# Altium schematic sheet PS3604LR.SchDoc: PS3604LR (part 2 of 3)
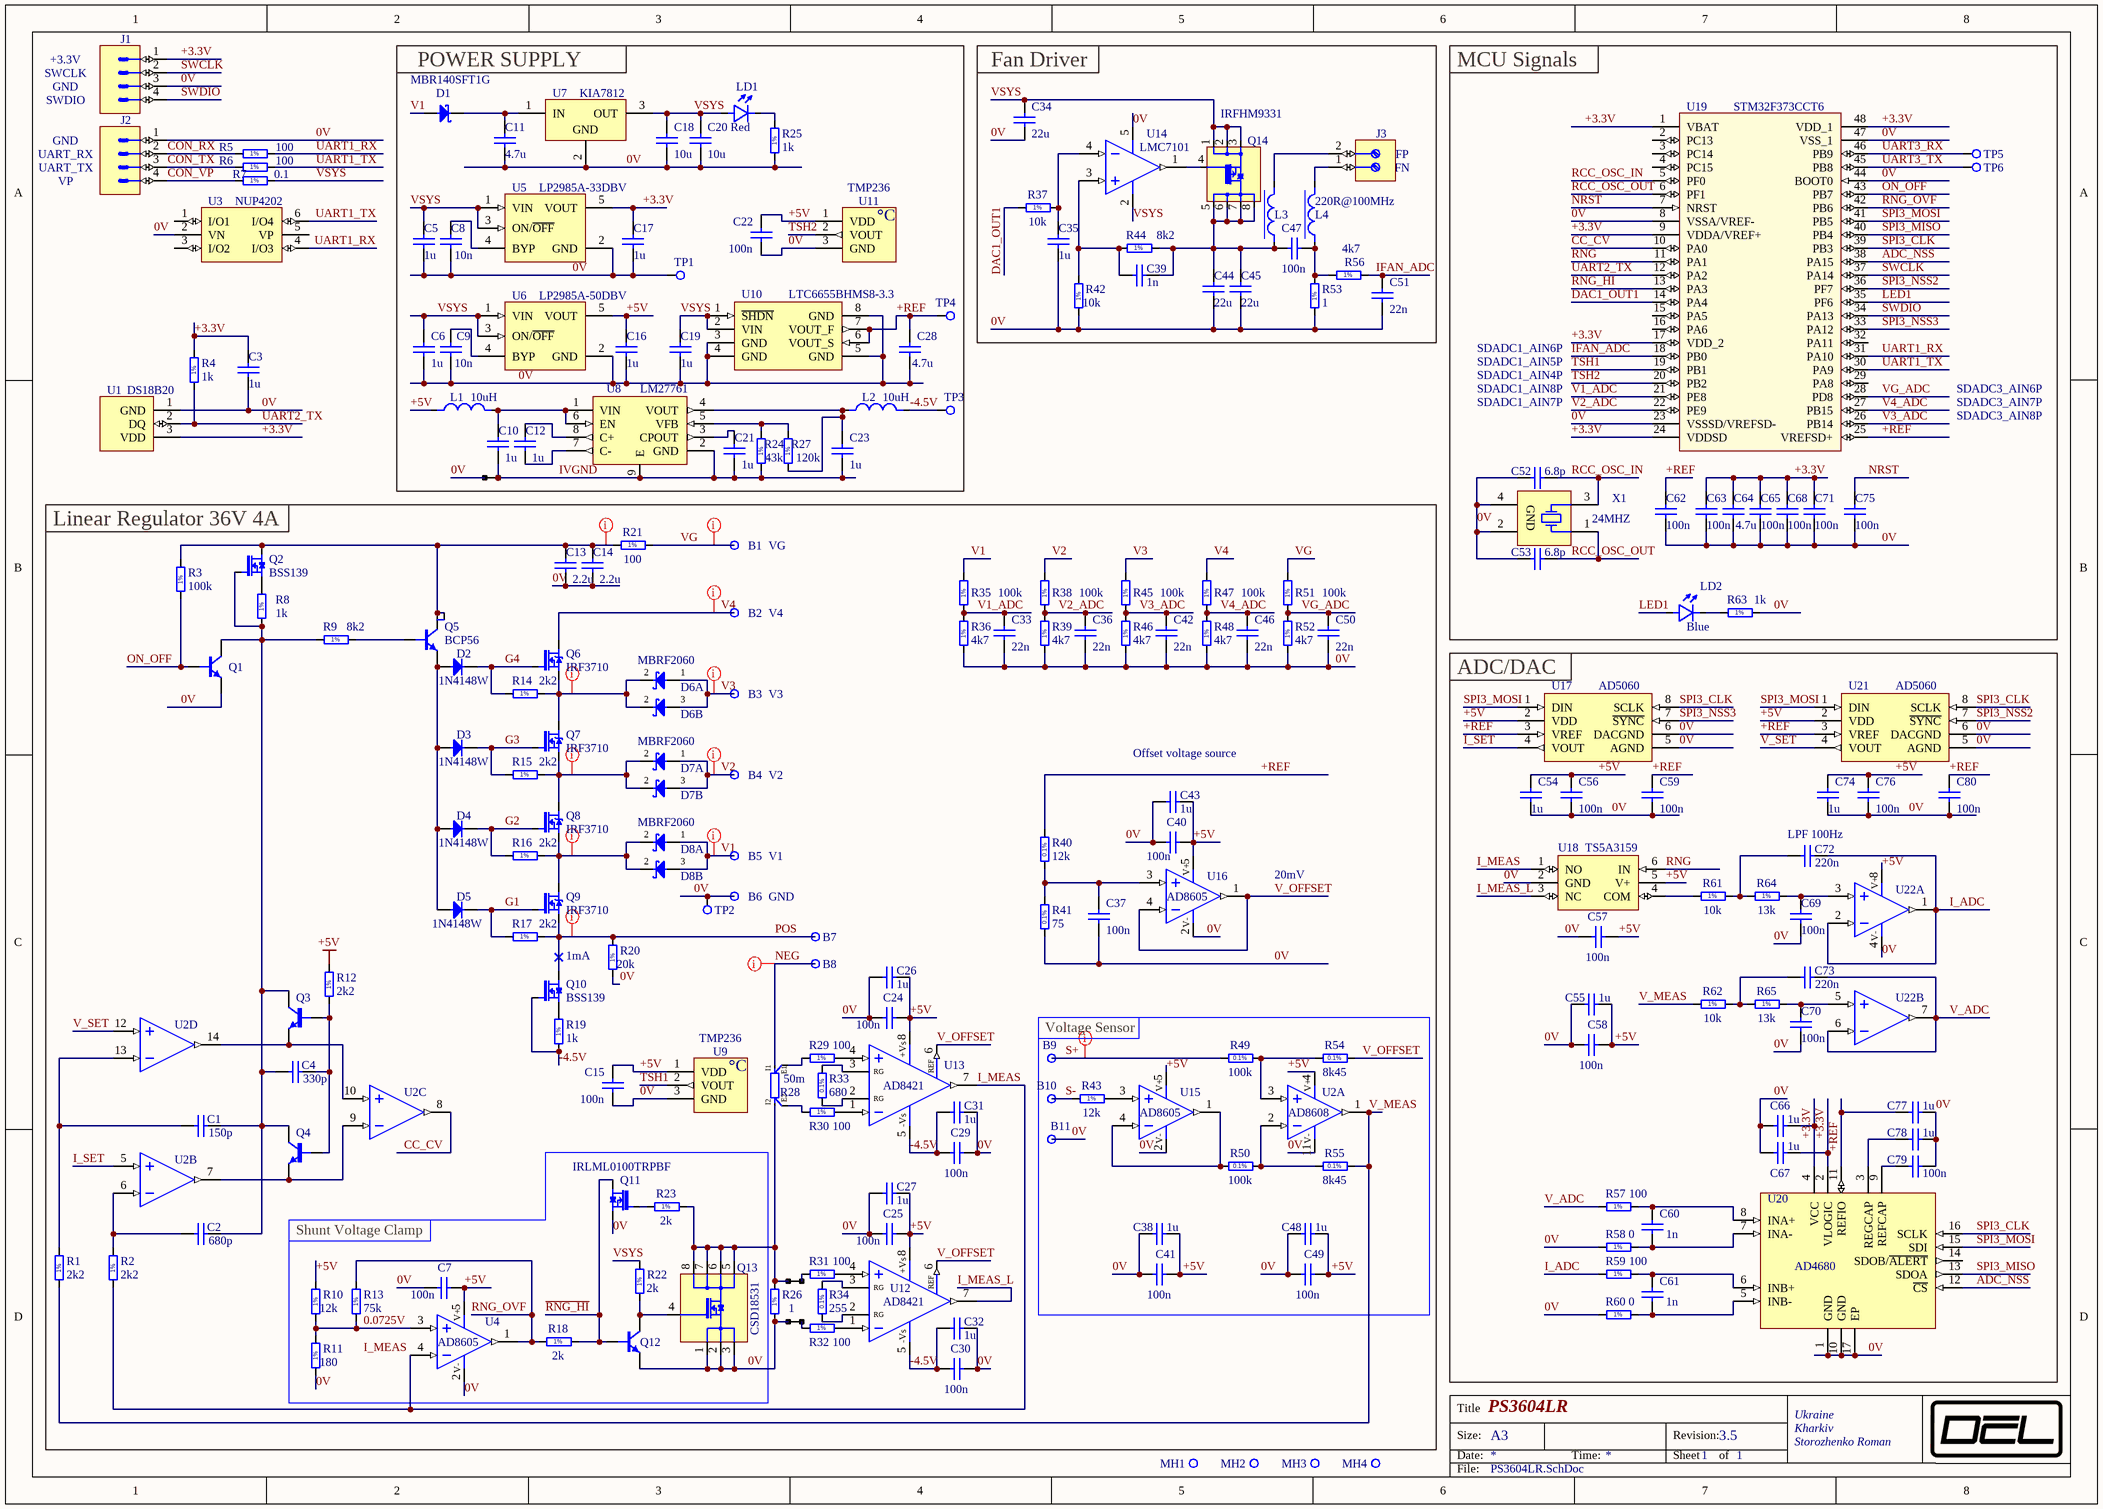
[diagram p1: PS3604LR.SchDoc]
## Library data of the parts
B1-B6 = PLATED_HOLE1.3_PAD2.5: Single Terminal Socket; Part Description: Plated Through Hole: Hole Dia.=1.3mm Pad Dia.=2.5mm; Mounted: No; Part Number: PLATED_HOLE1.3_PAD2.5; Component Kind: Standard (No BOM); Component Type: Standard (No BOM); Pin Count: 1; Family: Plated Hole; Socket: No; SMD: No; Status: None; ComponentHeight: 0mm; Author: DEL; CreateDate: 24.03.2018; LatestRevisionDate: 24.03.2018; PackageDescription: Plated Through Hole: Hole Dia.=1.3mm Pad Dia.=2.5mm
B7 B8 = PLATED_HOLE1.8_PAD3.2: Single Terminal Socket; Part Description: Plated Through Hole: Hole Dia.=1.8mm Pad Dia.=3.2mm; Mounted: No; Part Number: PLATED_HOLE1.8_PAD3.2; Component Kind: Standard (No BOM); Component Type: Standard (No BOM); Pin Count: 1; Family: Plated Hole; Socket: No; SMD: No; Status: None; ComponentHeight: 0mm; Author: DEL; CreateDate: 3/19/2026; LatestRevisionDate: 3/24/2018; PackageDescription: Plated Through Hole: Hole Dia.=1.8mm Pad Dia.=3.2mm
B9-B11 = PLATED_HOLE1.0_PAD1.5: Single Terminal Socket; Part Description: Plated Through Hole: Hole Dia.=1.0mm Pad Dia.=1.5mm; Mounted: No; Part Number: PLATED_HOLE1.0_PAD1.5; Component Kind: Standard (No BOM); Component Type: Standard (No BOM); Pin Count: 1; Family: Plated Hole; Socket: No; SMD: No; Status: None; ComponentHeight: 0mm; Author: CERN DEM JLC; CreateDate: 10/30/2008; LatestRevisionDate: 10/30/2008; PackageDescription: Plated Through Hole: Hole Dia.=1mm Pad Dia.=1.5mm
C1 = CC0805_150PF_50V_5%_NP0: Non-polarised capacitor; Part Description: SMD Multilayer Chip Ceramic Capacitor; Manufacturer: GENERIC; Manufacturer1 Part Number: B37940K5151J060; Voltage: 50V; TC: NP0; Tolerance: ±5%; Part Number: CC0805_150PF_50V_5%_NP0; Component Kind: Standard; Component Type: Standard; Pin Count: 2; Value: 150p; Status: Preferred; Manufacturer Part Number: CC0805_150PF_50V_5%_NP0; Case: 0805; Mounted: Yes; Socket: No; SMD: Yes; Manufacturer1 Example: EPCOS; Manufacturer1 ComponentHeight: 1.30mm; HelpURL: \\cern.ch\dfs\Applications\Altium\Datasheets\CC0805_NP0_EPCOS.pdf; Author: CERN DEM JLC; CreateDate: 12/3/2007; LatestRevisionDate: 12/3/2007
C2 = CC0805_680PF_50V_5%_NP0: Non-polarised capacitor; Part Description: SMD Multilayer Chip Ceramic Capacitor; Manufacturer: GENERIC; Manufacturer1 Part Number: 223886115681; Voltage: 50V; TC: NP0; Tolerance: ±5%; Part Number: CC0805_680PF_50V_5%_NP0; Component Kind: Standard; Component Type: Standard; Pin Count: 2; Value: 680p; Status: Preferred; Manufacturer Part Number: CC0805_680PF_50V_5%_NP0; Case: 0805; Mounted: Yes; Socket: No; SMD: Yes; Manufacturer1 Example: PHYCOMP; Manufacturer1 ComponentHeight: 1.35mm; HelpURL: \\cern.ch\dfs\Applications\Altium\Datasheets\CC0805_NP0_PHYCOMP.pdf; Author: CERN DEM JLC; CreateDate: 12/3/2007; LatestRevisionDate: 12/3/2007
C3 C5 C6 C10 C12 C16 C17 C19 C21 C23 C26 C27 C31 C32 C35 C38 C43 C48 C54 C55 C66 C67 C74 C77 C78 = CC0402_1UF_10V_20%_X5R: Non-polarised capacitor; Part Description: SMD Multilayer Chip Ceramic Capacitor; Manufacturer: GENERIC; Voltage: 10V; TC: X5R; Tolerance: ±20%; Part Number: CC0402_1UF_10V_20%_X5R; Component Kind: Standard; Component Type: Standard; Pin Count: 2; Value: 1u; Status: Preferred; Manufacturer Part Number: CC0402_1UF_10V_20%_X5R; Case: 0402; Mounted: Yes; Socket: No; SMD: Yes; Manufacturer1 ComponentHeight: 0.55mm; HelpURL: \\cern.ch\dfs\Applications\Altium\Datasheets\CC0402_X5R_KEMET.pdf; Author: ELMAN; CreateDate: 20.05.2015; LatestRevisionDate: 20.05.2015
C4 = CC0805_330PF_50V_5%_NP0: Non-polarised capacitor; Part Description: SMD Multilayer Chip Ceramic Capacitor; Manufacturer: GENERIC; Manufacturer1 Part Number: 223886115331; Voltage: 50V; TC: NP0; Tolerance: ±5%; Part Number: CC0805_330PF_50V_5%_NP0; Component Kind: Standard; Component Type: Standard; Pin Count: 2; Value: 330p; Status: Preferred; Manufacturer Part Number: CC0805_330PF_50V_5%_NP0; Case: 0805; Mounted: Yes; Socket: No; SMD: Yes; Manufacturer1 Example: PHYCOMP; Manufacturer1 ComponentHeight: 1.35mm; HelpURL: \\cern.ch\dfs\Applications\Altium\Datasheets\CC0805_NP0_PHYCOMP.pdf; Author: CERN DEM JLC; CreateDate: 12/3/2007; LatestRevisionDate: 12/3/2007
C7 C15 C22 C24 C25 C29 C30 C37 C40 C41 C47 C49 C56-C59 C62 C63 C65 C68-C71 C75 C76 C79 C80 = CC0402_100NF_50V_10%_X7R: Non-polarised capacitor; Part Description: SMD Multilayer Chip Ceramic Capacitor; Manufacturer: GENERIC; Manufacturer1 Part Number: C0402B104K500NU; Voltage: 50V; TC: X7R; Tolerance: ±10%; Part Number: CC0402_100NF_50V_10%_X7R; Component Kind: Standard; Component Type: Standard; Pin Count: 2; Value: 100n; Status: Not Recommended; Manufacturer Part Number: CC0402_100NF_50V_10%_X7R; Case: 0402; Mounted: Yes; Socket: No; SMD: Yes; Manufacturer1 Example: HITANO; Manufacturer1 ComponentHeight: 0.55mm; Author: DEL; CreateDate: 13.11.2017; LatestRevisionDate: 13.11.2017
C8 C9 = CC0402_10NF_50V_10%_X7R: Non-polarised capacitor; Part Description: SMD Multilayer Chip Ceramic Capacitor; Manufacturer: GENERIC; Manufacturer1 Part Number: C0402C103K5RACTU; Voltage: 50V; TC: X7R; Tolerance: ±10%; Part Number: CC0402_10NF_50V_10%_X7R; Component Kind: Standard; Component Type: Standard; Pin Count: 2; Value: 10n; Status: None; Manufacturer Part Number: CC0402_10NF_50V_10%_X7R; Case: 0402; Mounted: Yes; Socket: No; SMD: Yes; Manufacturer1 Example: KEMET; Manufacturer1 ComponentHeight: 0.55mm; Author: DEL; CreateDate: 19.12.2017; LatestRevisionDate: 19.12.2017
C11 = CC1206_4.7UF_50V_10%_X7R: Non-polarised capacitor; Part Description: SMD Multilayer Chip Ceramic Capacitor; Manufacturer: GENERIC; Manufacturer1 Part Number: CL31B475KBHNNNE; Voltage: 50V; TC: X7R; Tolerance: ±10%; Part Number: CC1206_4.7UF_50V_10%_X7R; Component Kind: Standard; Component Type: Standard; Pin Count: 2; Value: 4.7u; Status: Preferred; Manufacturer Part Number: CC1206_4.7UF_50V_10%_X7R; Case: 1206; Mounted: Yes; Socket: No; SMD: Yes; Manufacturer1 Example: SAMSUNG; Manufacturer1 ComponentHeight: 1.8mm; Author: DEL; CreateDate: 13.11.2017; LatestRevisionDate: 13.11.2017
C13 C14 = CC1206_2.2UF_100V_10%_X7R: Non-polarised capacitor; Part Description: SMD Multilayer Chip Ceramic Capacitor; Manufacturer: GENERIC; Manufacturer1 Part Number: C1206C225K4RAC; Voltage: 100V; TC: X7R; Tolerance: ±10%; Part Number: CC1206_2.2UF_100V_10%_X7R; Component Kind: Standard; Component Type: Standard; Pin Count: 2; Value: 2.2u; Status: Preferred; Manufacturer Part Number: CC1206_2.2UF_100V_10%_X7R; Case: 1206; Mounted: Yes; Socket: No; SMD: Yes; Manufacturer1 Example: SAMSUNG; Manufacturer1 ComponentHeight: 1.75mm; Author: DEL; CreateDate: 6/15/2025; LatestRevisionDate: 6/15/2025
C18 C20 = CC1206_10UF_16V_10%_X7R: Non-polarised capacitor; Part Description: SMD Multilayer Chip Ceramic Capacitor; Manufacturer: GENERIC; Manufacturer1 Part Number: C1206C106K4RAC; Voltage: 16V; TC: X7R; Tolerance: ±10%; Part Number: CC1206_10UF_16V_10%_X7R; Component Kind: Standard; Component Type: Standard; Pin Count: 2; Value: 10u; Status: Preferred; Manufacturer Part Number: CC1206_10uF_16V_10%_X7R; Case: 1206; Mounted: Yes; Socket: No; SMD: Yes; Manufacturer1 Example: KEMET; Manufacturer1 ComponentHeight: 1.8mm; HelpURL: \\cern.ch\dfs\Applications\Altium\Datasheets\CC1206_X7R_KEMET.pdf; Author: CERN DEM JLC; CreateDate: 2009-04-28; LatestRevisionDate: 2009-04-28
C28 C64 = CC0402_4.7UF_10V_20%_X5R: Non-polarised capacitor; Part Description: SMD Multilayer Chip Ceramic Capacitor; Manufacturer: GENERIC; Voltage: 10V; TC: X5R; Tolerance: ±20%; Part Number: CC0402_4.7UF_10V_20%_X5R; Component Kind: Standard; Component Type: Standard; Pin Count: 2; Value: 4.7u; Status: Preferred; Manufacturer Part Number: CC0402_4.7UF_10V_20%_X5R; Case: 0402; Mounted: Yes; Socket: No; SMD: Yes; Manufacturer1 ComponentHeight: 0.55mm; Author: DEL; CreateDate: 1/19/2025; LatestRevisionDate: 1/19/2025
C33 C36 C42 C46 C50 C51 = CC0402_22NF_16V_10%_X7R: Non-polarised capacitor; Part Description: SMD Multilayer Chip Ceramic Capacitor; Manufacturer: GENERIC; Manufacturer1 Part Number: 223878715641; Voltage: 16V; TC: X7R; Tolerance: ±10%; Part Number: CC0402_22NF_16V_10%_X7R; Component Kind: Standard; Component Type: Standard; Pin Count: 2; Value: 22n; Status: Not Recommended; Manufacturer Part Number: CC0402_22NF_16V_10%_X7R; Case: 0402; Mounted: Yes; Socket: No; SMD: Yes; Manufacturer1 Example: PHYCOMP; Manufacturer1 ComponentHeight: 0.55mm; HelpURL: \\cern.ch\dfs\Applications\Altium\Datasheets\CC0402_X7R_PHYCOMP.pdf; Author: CERN DEM JLC; CreateDate: 03.12.2007; LatestRevisionDate: 03.12.2007
C34 C44 C45 = CC1206_22UF_16V_20%_X5R: Non-polarised capacitor; Part Description: SMD Multilayer Chip Ceramic Capacitor; Manufacturer: GENERIC; Manufacturer1 Part Number: CL31A226MOCLNNC; Voltage: 16V; TC: X5R; Tolerance: ±20%; Part Number: CC1206_22UF_16V_20%_X5R; Component Kind: Standard; Component Type: Standard; Pin Count: 2; Value: 22u; Status: Preferred; Manufacturer Part Number: CC1206_22UF_16V_20%_X5R; Case: 1206; Mounted: Yes; Socket: No; SMD: Yes; Manufacturer1 Example: Samsung; Manufacturer1 ComponentHeight: 1mm; Author: D_EL; CreateDate: 13.06.2017; LatestRevisionDate: 13.06.2017
C39 C60 C61 = CC0402_1NF_50V_5%_NP0: Non-polarised capacitor; Part Description: SMD Multilayer Chip Ceramic Capacitor; Manufacturer: GENERIC; Manufacturer1 Part Number: GRM1555C1H102JA01D; Voltage: 50V; TC: NP0; Tolerance: ±5%; Part Number: CC0402_1NF_50V_5%_NP0; Component Kind: Standard; Component Type: Standard; Pin Count: 2; Value: 1n; Status: Not Recommended; Manufacturer Part Number: CC0402_1NF_50V_5%_NP0; Case: 0402; Mounted: Yes; Socket: No; SMD: Yes; Manufacturer1 Example: PHYCOMP; Manufacturer1 ComponentHeight: 0.55mm; Author: ROMAN; CreateDate: 2016-07-20; LatestRevisionDate: 2016-07-20
C52 C53 = CC0402_6.8PF_50V_0.5PF_NP0: Non-polarised capacitor; Part Description: SMD Multilayer Chip Ceramic Capacitor; Manufacturer: GENERIC; Manufacturer1 Part Number: 223886915688; Voltage: 50V; TC: NP0; Tolerance: ±0.5pF; Part Number: CC0402_6.8PF_50V_0.5PF_NP0; Component Kind: Standard; Component Type: Standard; Pin Count: 2; Value: 6.8p; Status: Not Recommended; Manufacturer Part Number: CC0402_6.8PF_50V_0.5PF_NP0; Case: 0402; Mounted: Yes; Socket: No; SMD: Yes; Manufacturer1 Example: PHYCOMP; Manufacturer1 ComponentHeight: 0.55mm; HelpURL: \\cern.ch\dfs\Applications\Altium\Datasheets\CC0402_NP0_PHYCOMP.pdf; Author: CERN DEM JLC; CreateDate: 03.12.2007; LatestRevisionDate: 03.12.2007
C72 C73 = CC0402_220NF_6.3V_10%_X5R: Non-polarised capacitor; Part Description: SMD Multilayer Chip Ceramic Capacitor; Manufacturer: GENERIC; Manufacturer1 Part Number: GRM155R60J474KE19D; Voltage: 6.3V; TC: X5R; Tolerance: ±10%; Part Number: CC0402_220NF_6.3V_10%_X5R; Component Kind: Standard; Component Type: Standard; Pin Count: 2; Value: 220n; Status: Preferred; Manufacturer Part Number: CC0402_220NF_6.3V_10%_X5R; Case: 0402; Mounted: Yes; Socket: No; SMD: Yes; Manufacturer1 Example: KEMET; Manufacturer1 ComponentHeight: 0.55mm; HelpURL: \\cern.ch\dfs\Applications\Altium\Datasheets\CC0402_X5R_KEMET.pdf; Author: CERN DEM JLC; CreateDate: 4/22/2010; LatestRevisionDate: 4/22/2010
D1 = MBR140SFT1G: Schottky Diode; Part Description: Schottky Power Rectifier; Manufacturer: ON SEMICONDUCTOR; Voltage: 40V; Power: 1A; Part Number: MBR140SFT1G; Component Kind: Standard; Component Type: Standard; Device: MBR140SFT1G; PackageDescription: Small Outline Diode Flat Lead (SOD-123FL), Body; 2.70mm L X 1.65mm W X 1.0mm H; Manufacturer Part Number: MBR140SFT1G; Pin Count: 2; Case: SOD-123FL; Mounted: Yes; Socket: No; SMD: Yes; ComponentHeight: 1.0mm; HelpURL: \\cern.ch\dfs\Applications\Altium\Datasheets\MBR140SFT1G.pdf; Author: CERN DEM JLC; CreateDate: 06.04.2009; LatestRevisionDate: 06.04.2009
D2-D5 = 1N4148W: Diode; Part Description: Small Signal Diode; Manufacturer: VISHAY SEMICONDUCTORS; Manufacturer Part Number: 1N4148W-E3-08; Voltage: 75V; Power: 150mA; Part Number: 1N4148W; Component Kind: Standard; Component Type: Standard; Device: 1N4148W; PackageDescription: SOD Diode (SOD-123); 2.70mm W X 1.55mm L X 1.45mm H body, IPC Medium Density; Pin Count: 2; Case: SOD-123; Mounted: Yes; Socket: No; SMD: Yes; ComponentHeight: 1.45mm; Author: DEL; CreateDate: 27.01.2018; LatestRevisionDate: 27.01.2018
D6-D8 = MBRF2060CTG_h_outside: Dual Common Cathode Schottky Diodes; Part Description: Switch-mode Schottky Power Rectifier (Common Cathode); Manufacturer: ON SEMICONDUCTOR; Voltage: 60V; Power: 10A; Part Number: MBRF2060CTG_h_outside; Component Kind: Standard; Component Type: Standard; Device: MBRF2060; PackageDescription: TO-220 3-Terminal  Horizontal Outside Mount; Manufacturer Part Number: MBRF2060CTG; Pin Count: 3; Case: TO-220; Mounted: Yes; Socket: No; SMD: No; ComponentHeight: 10mm; Author: DEL; CreateDate: 06.05.2018; LatestRevisionDate: 06.05.2018
J1 = 3M_929550-0104-EU: Connector 4 Male; Part Description: 10 Contacts - Horizontal Contacts Straight Strip Header Pitch 2.54; Manufacturer: 3M; Part Number: 3M_929550-0104-EU; Component Kind: Standard; Component Type: Standard; Pin Count: 4; Family: Header 4; Mounted: Yes; Socket: No; SMD: No; Status: None; Manufacturer Part Number: 3M_929550-0104-EU; ComponentHeight: 6mm; Author: DEL; CreateDate: 05.07.2018; LatestRevisionDate: 05.07.2018
J2 = MOLEX_22-03-5045: Connector 4 Male; Part Description: 2.50mm Pitch SPOX Wire-to-Board Header, Vertical, Shrouded, 4 Circuits, Tin (Sn) Plating; Manufacturer: MOLEX; Part Number: MOLEX_22-03-5045; Component Kind: Standard; Component Type: Standard; Pin Count: 4; Family: SPOX; Mounted: Yes; Socket: No; SMD: No; Status: None; Manufacturer Part Number: 22-27-2041; ComponentHeight: 5.9mm; Author: DEL; CreateDate: 21.10.2017; LatestRevisionDate: 21.10.2017
J3 = PHOENIX_1725656: Terminal Block, 2 Positions, Screw Connection; Part Description: 6A, 63V, Terminal Block, Pitch 2.54mm, 2 Positions, Screw Connection; Manufacturer: PHOENIX CONTACT; Manufacturer Part Number: 1725656 (MPT 0,5/2-2,54); Part Number: PHOENIX_1725656; Component Kind: Standard; Component Type: Standard; Pin Count: 2; Mounted: Yes; Socket: No; SMD: No; Status: None; ComponentHeight: 8.5mm; HelpURL: \\cern.ch\dfs\Applications\Altium\Datasheets\PHOENIX_1725656.pdf; Author: CERN DEM JMW; CreateDate: 07.11.2008; LatestRevisionDate: 26.04.2010
L1 L2 = IND0603_10UH_MURATA_LQM18FN100M00D: Inductor; Part Description: Chip Inductors; Manufacturer: MURATA; Power: 50mA; Resistance: 1.17R; Tolerance: ±20%; Part Number: IND0603_10UH_MURATA_LQM18FN100M00D; Component Kind: Standard; Component Type: Standard; Pin Count: 2; Value: 10uH; Status: None; Manufacturer Part Number: LQM18FN100M00D; Case: 0603; Mounted: Yes; Socket: No; SMD: Yes; ComponentHeight: 0.9mm; Author: DEL; CreateDate: 3/17/2018; LatestRevisionDate: 3/17/2018
L3 L4 = FB0603_SAMSUNG_CIS10P221NC: Inductor With Magnetic core; Part Description: SMT Ferrite bead; Power: 2.5A; Resistance: 50mOhm; Part Number: FB0603_SAMSUNG_CIS10P221NC; Component Kind: Standard; Component Type: Standard; Pin Count: 2; Value: 220R@100MHz; Status: Preferred; Manufacturer: SAMSUNG; Manufacturer Part Number: CIS10P221NC; Case: 0603; Mounted: Yes; Socket: No; SMD: Yes; ComponentHeight: 0.95mm; Author: ELMAN; CreateDate: 11/14/2016; LatestRevisionDate: 11/14/2016
LD1 = LED_OF-SMD1608R: LED 1C 2A; Part Description: Surface Mount Red LED (0603 Case); Manufacturer: OPTOFLASH; Part Number: LED_OF-SMD1608R; Component Kind: Standard; Component Type: Standard; Color: Red; PackageDescription: Chip Red LED, 2-Leads, Body 1.6x0.8mm, IPC Medium Density; Manufacturer Part Number: OF-SMD1608R; Pin Count: 2; Case: 0603; Mounted: Yes; Socket: No; SMD: Yes; ComponentHeight: 0.8mm; Author: ELMAN; CreateDate: 27.08.2015; LatestRevisionDate: 27.08.2015
LD2 = LED_OF-SMD1608B: LED 1C 2A; Part Description: Surface Mount Red LED (0603 Case); Manufacturer: OPTOFLASH; Part Number: LED_OF-SMD1608B; Component Kind: Standard; Component Type: Standard; Color: Blue; PackageDescription: Chip Blue LED, 2-Leads, Body 1.6x0.8mm, IPC Medium Density; Manufacturer Part Number: OF-SMD1608B; Pin Count: 2; Case: 0603; Mounted: Yes; Socket: No; SMD: Yes; ComponentHeight: 0.8mm; Author: DEL; CreateDate: 11.12.2017; LatestRevisionDate: 11.12.2017
MH1-MH4 = NON-PLATED_HOLE3.2_PAD6.0_8p: Single Terminal Socket; Part Description: Through Hole: Hole Dia.=3.2mm Pad Dia.=6mm + 6 Via Dia.=0.3mm; Mounted: No; Part Number: NON-PLATED_HOLE3.2_PAD6.0_8p; Component Kind: Standard (No BOM); Component Type: Standard (No BOM); Pin Count: 1; Family: Non Plated Hole; Socket: No; SMD: No; Status: None; ComponentHeight: 0mm; Author: DEL; CreateDate: 11/21/2022; LatestRevisionDate: 11/21/2022; PackageDescription: Non Plated Through Hole: Hole Dia.=3.2mm
n1-n3 = NET_TIE_0.25_0.4: Part Description: Wire bridge, W 0.25mm, L 0.4mm; Mounted: No; Part Number: NET_TIE_0.25_0.4; Component Type: Net Tie (No BOM); Pin Count: 2; Socket: No; SMD: No; Status: None; ComponentHeight: 0mm; Author: DEL; CreateDate: 1/19/2025; LatestRevisionDate: 1/19/2025; PackageDescription: Wire bridge, W 0.25mm, L 0.4mm
Q1 Q3 Q4 Q12 = MMBT5551L: NPN Transistor; Part Description: 160V 600A NPN General Purpose Amplifier; Manufacturer: ON SEMICONDICTOR; Manufacturer Part Number: MMBT5551LT3G; Part Number: MMBT5551L; Component Kind: Standard; Component Type: Standard; Device: MMBT5551; PackageDescription: SOT23 3-Leads, Pitch 0.95mm - Body 1.4x3mm, IPC Medium Density; Pin Count: 3; Case: SOT23-3; Mounted: Yes; Socket: No; SMD: Yes; ComponentHeight: 1.3mm; Author: DEL; CreateDate: 27.01.2018; LatestRevisionDate: 27.01.2018
Q2 Q10 = BSS139: N-CHANNEL MOSFET Depletion-mode WITH DIODE; Part Description: 250V 0.1A N-Channel MOSFET Depletion-mode; Manufacturer: INFINEON; Manufacturer Part Number: BSS139H6327XTSA1; Part Number: BSS139; Component Kind: Standard; Component Type: Standard; Device: BSS139; PackageDescription: SOT23 3-Leads, Pitch 0.95mm - Body 1.3x2.9mm, IPC Medium Density; Pin Count: 3; Case: SOT23-3; Mounted: Yes; Socket: No; SMD: Yes; ComponentHeight: 1.4mm; Author: D_EL; CreateDate: 2018-09-19; LatestRevisionDate: 2018-09-19
Q5 = BCP56: NPN Transistor; Part Description: 80V 1A NPN Medium Power Transistor; Manufacturer: NXP SEMICONDUCTORS; Part Number: BCP56; Component Kind: Standard; Component Type: Standard; Device: BCP56; PackageDescription: SOT223 4-Leads, Pitch 2.30mm, Body 6.7x7.3mm (max), IPC Medium Density; Manufacturer Part Number: BCP56; Pin Count: 4; Case: SOT223; Mounted: Yes; Socket: No; SMD: Yes; ComponentHeight: 1.8mm; Author: DEL; CreateDate: 28.01.2018; LatestRevisionDate: 28.01.2018
Q6-Q9 = IRF3710_h_outside: N-CHANNEL MOSFET WITH ZENER DIODE; Part Description: 100V 57A 0.023 Ohm N-Channel Power MOSFET; Manufacturer: INTERNATIONAL RECTIFIER; Manufacturer Part Number: IRF3710PBF; Part Number: IRF3710_h_outside; Component Kind: Standard; Component Type: Standard; Device: IRF3710; PackageDescription: TO-220 3-Terminal  Horizontal Outside Mount; Pin Count: 3; Case: TO-220; Mounted: Yes; Socket: No; SMD: No; ComponentHeight: 10mm; Author: DEL; CreateDate: 05.05.2018; LatestRevisionDate: 05.05.2018
Q11 = IRLML0100TRPBF: N-CHANNEL MOSFET WITH DIODE; Part Description: 100V 1.6A N-Channel HEXFET® Power MOSFET; Manufacturer: INTERNATIONAL RECTIFIER; Part Number: IRLML0100TRPBF; Component Kind: Standard; Component Type: Standard; Device: IRLML0100TRPBF; PackageDescription: SOT, 0.95mm, pitch; 3 pin,1.30mm W X 2.92mm L X 1.12mm H body, IPC Medium Density; Manufacturer Part Number: IRLML0100TRPBF; Pin Count: 3; Case: SOT23-3; Mounted: Yes; Socket: No; SMD: Yes; ComponentHeight: 1.12mm; HelpURL: \\cern.ch\dfs\Applications\Altium\Datasheets\IRLML0100TRPBF.pdf; Author: CERN DEM JLC; CreateDate: 10/6/2011; LatestRevisionDate: 10/6/2011
Q13 = CSD18531Q5A: Part Description: 60V 100A 4mOhm N-Channel NexFET; Manufacturer: TEXAS INSTRUMENTS; Part Number: CSD18531Q5A; Component Kind: Standard; Component Type: Standard; Device: CSD18531; PackageDescription: DFN 5x6; Manufacturer Part Number: CSD18531Q5A; Pin Count: 8; Case: DFN-5X6; Mounted: Yes; Socket: No; SMD: Yes; ComponentHeight: 1mm; Author: DEL; CreateDate: 3/21/2025; LatestRevisionDate: 3/21/2025
Q14 = IRFHM9331TRPbF: P-CHANNEL MOSFET WITH DIODE; Part Description: -30V 11A 0.014 Ohm P-Channel  MOSFET; Manufacturer: INFINEON; Part Number: IRFHM9331TRPbF; Component Kind: Standard; Component Type: Standard; Device: IRFHM9331; PackageDescription: PQFN, 8-Leads, Body 3,00x3,00mm, Pitch 0,50mm, Thermal Pad 4,00x2,20mm, IPC Medium Density; Manufacturer Part Number: IRFHM9331TRPbF; Pin Count: 8; Case: PQFN; Mounted: Yes; Socket: No; SMD: Yes; ComponentHeight: 1mm; Author: DEL; CreateDate: 29.01.2018; LatestRevisionDate: 29.01.2018
R1 R2 R12 = R0402_2K2_1%_0.0625W_100PPM: Resistor - 1%; Part Description: General Purpose Thick Film Chip Resistor; Manufacturer: GENERIC; Manufacturer1 Part Number: 232270672202; TC: ±100ppm/°C; Part Number: R0402_2K2_1%_0.0625W_100PPM; Component Kind: Standard; Component Type: Standard; Pin Count: 2; Value: 2k2; Status: Not recommended; Power: 0.0625W; Tolerance: ±1%; Manufacturer Part Number: R0402_2K2_1%_0.0625W_100PPM; Case: 0402; Mounted: Yes; Socket: No; SMD: Yes; Manufacturer1 Example: PHYCOMP; Manufacturer1 ComponentHeight: 0.4mm; HelpURL: \\cern.ch\dfs\Applications\Altium\Datasheets\R0402_Phycomp_RC0402.pdf; Author: CERN DEM JLC; CreateDate: 03.12.2007; LatestRevisionDate: 13.03.2008
R3 R35 R38 R45 R47 R51 = R0805_100K_1%_0.125W_100PPM: Resistor - 1%; Part Description: General Purpose Thick Film Chip Resistor; Manufacturer: GENERIC; Manufacturer1 Part Number: NRC10F1003TRF; Power: 0.125W; TC: ±100ppm/°C; Part Number: R0805_100K_1%_0.125W_100PPM; Component Kind: Standard; Component Type: Standard; Pin Count: 2; Value: 100k; Status: Preferred; Tolerance: ±1%; Manufacturer Part Number: R0805_100K_1%_0.125W_100PPM; Case: 0805; Mounted: Yes; Socket: No; SMD: Yes; Manufacturer1 Example: NIC COMPONENT; Manufacturer1 ComponentHeight: 0.6mm; HelpURL: \\cern.ch\dfs\Applications\Altium\Datasheets\R0805_NIC_NRC.pdf; Author: CERN DEM JLC; CreateDate: 03.12.2007; LatestRevisionDate: 13.03.2008
R4 R8 R25 R63 = R0402_1K_1%_0.0625W_100PPM: Resistor - 1%; Part Description: General Purpose Thick Film Chip Resistor; Manufacturer: GENERIC; Manufacturer1 Part Number: 232270671002; TC: ±100ppm/°C; Part Number: R0402_1K_1%_0.0625W_100PPM; Component Kind: Standard; Component Type: Standard; Pin Count: 2; Value: 1k; Status: Not recommended; Power: 0.0625W; Tolerance: ±1%; Manufacturer Part Number: R0402_1K_1%_0.0625W_100PPM; Case: 0402; Mounted: Yes; Socket: No; SMD: Yes; Manufacturer1 Example: PHYCOMP; Manufacturer1 ComponentHeight: 0.4mm; HelpURL: \\cern.ch\dfs\Applications\Altium\Datasheets\R0402_Phycomp_RC0402.pdf; Author: CERN DEM JLC
  R4 R25 R63: CreateDate: 03.12.2007; LatestRevisionDate: 13.03.2008
  R8: CreateDate: 2007-12-03; LatestRevisionDate: 2008-03-13
R5 R6 R29-R32 R57 R59 = R0402_100R_1%_0.0625W_100PPM: Resistor - 1%; Part Description: General Purpose Thick Film Chip Resistor; Manufacturer: GENERIC; Manufacturer1 Part Number: 232270671001; TC: ±100ppm/°C; Part Number: R0402_100R_1%_0.0625W_100PPM; Component Kind: Standard; Component Type: Standard; Pin Count: 2; Value: 100; Status: Not recommended; Power: 0.0625W; Tolerance: ±1%; Manufacturer Part Number: R0402_100R_1%_0.0625W_100PPM; Case: 0402; Mounted: Yes; Socket: No; SMD: Yes; Manufacturer1 Example: PHYCOMP; Manufacturer1 ComponentHeight: 0.4mm; HelpURL: \\cern.ch\dfs\Applications\Altium\Datasheets\R0402_Phycomp_RC0402.pdf; Author: CERN DEM JLC
  R5 R6: CreateDate: 03.12.2007; LatestRevisionDate: 13.03.2008
  R29-R32 R57 R59: CreateDate: 12/3/2007; LatestRevisionDate: 3/13/2008
R7 = R0603_0R1_1%_0.1W_100PPM: Resistor - 1%; Part Description: General Purpose Thick Film Chip Resistor; Manufacturer: GENERIC; Manufacturer1 Part Number: PE0603FRF070R1L; Power: 0.1W; TC: ±100ppm/°C; Part Number: R0603_0R1_1%_0.1W_100PPM; Component Kind: Standard; Component Type: Standard; Pin Count: 2; Value: 0.1; Status: Preferred; Tolerance: ±1%; Manufacturer Part Number: R0603_0R1_1%_0.1W_100PPM; Case: 0603; Mounted: Yes; Socket: No; SMD: Yes; Manufacturer1 Example: YAGEO; Manufacturer1 ComponentHeight: 0.55mm; Author: DEL; CreateDate: 7/21/2023; LatestRevisionDate: 7/21/2023
R9 R44 = R0402_8K2_1%_0.0625W_100PPM: Resistor - 1%; Part Description: General Purpose Thick Film Chip Resistor; Manufacturer: GENERIC; Manufacturer1 Part Number: 232270678202; TC: ±100ppm/°C; Part Number: R0402_8K2_1%_0.0625W_100PPM; Component Kind: Standard; Component Type: Standard; Pin Count: 2; Value: 8k2; Status: Not recommended; Power: 0.0625W; Tolerance: ±1%; Manufacturer Part Number: R0402_8K2_1%_0.0625W_100PPM; Case: 0402; Mounted: Yes; Socket: No; SMD: Yes; Manufacturer1 Example: PHYCOMP; Manufacturer1 ComponentHeight: 0.4mm; HelpURL: \\cern.ch\dfs\Applications\Altium\Datasheets\R0402_Phycomp_RC0402.pdf; Author: CERN DEM JLC; CreateDate: 12/3/2007; LatestRevisionDate: 3/13/2008
R10 R43 = R0402_12K_1%_0.0625W_100PPM: Resistor - 1%; Part Description: General Purpose Thick Film Chip Resistor; Manufacturer: GENERIC; Manufacturer1 Part Number: 232270671203; TC: ±100ppm/°C; Part Number: R0402_12K_1%_0.0625W_100PPM; Component Kind: Standard; Component Type: Standard; Pin Count: 2; Value: 12k; Status: Not recommended; Power: 0.0625W; Tolerance: ±1%; Manufacturer Part Number: R0402_12K_1%_0.0625W_100PPM; Case: 0402; Mounted: Yes; Socket: No; SMD: Yes; Manufacturer1 Example: PHYCOMP; Manufacturer1 ComponentHeight: 0.4mm; HelpURL: \\cern.ch\dfs\Applications\Altium\Datasheets\R0402_Phycomp_RC0402.pdf; Author: CERN DEM JLC; CreateDate: 12/3/2007; LatestRevisionDate: 3/13/2008
R11 = R0402_180R_1%_0.0625W_100PPM: Resistor - 1%; Part Description: General Purpose Thick Film Chip Resistor; Manufacturer: GENERIC; Manufacturer1 Part Number: 232270671801; TC: ±100ppm/°C; Part Number: R0402_180R_1%_0.0625W_100PPM; Component Kind: Standard; Component Type: Standard; Pin Count: 2; Value: 180; Status: Not recommended; Power: 0.0625W; Tolerance: ±1%; Manufacturer Part Number: R0402_180R_1%_0.0625W_100PPM; Case: 0402; Mounted: Yes; Socket: No; SMD: Yes; Manufacturer1 Example: PHYCOMP; Manufacturer1 ComponentHeight: 0.4mm; HelpURL: \\cern.ch\dfs\Applications\Altium\Datasheets\R0402_Phycomp_RC0402.pdf; Author: CERN DEM JLC; CreateDate: 12/3/2007; LatestRevisionDate: 3/13/2008
R13 = R0402_75K_1%_0.0625W_100PPM: Resistor - 1%; Part Description: General Purpose Thick Film Chip Resistor; Manufacturer: GENERIC; Manufacturer1 Part Number: 232270677503; TC: ±100ppm/°C; Part Number: R0402_75K_1%_0.0625W_100PPM; Component Kind: Standard; Component Type: Standard; Pin Count: 2; Value: 75k; Status: Not recommended; Power: 0.0625W; Tolerance: ±1%; Manufacturer Part Number: R0402_75K_1%_0.0625W_100PPM; Case: 0402; Mounted: Yes; Socket: No; SMD: Yes; Manufacturer1 Example: PHYCOMP; Manufacturer1 ComponentHeight: 0.4mm; HelpURL: \\cern.ch\dfs\Applications\Altium\Datasheets\R0402_Phycomp_RC0402.pdf; Author: CERN DEM JLC; CreateDate: 12/3/2007; LatestRevisionDate: 3/13/2008
R14-R17 = R0805_2K2_1%_0.125W_100PPM: Resistor - 1%; Part Description: General Purpose Thick Film Chip Resistor; Manufacturer: GENERIC; Manufacturer1 Part Number: NRC10F2201TRF; Power: 0.125W; TC: ±100ppm/°C; Part Number: R0805_2K2_1%_0.125W_100PPM; Component Kind: Standard; Component Type: Standard; Pin Count: 2; Value: 2k2; Status: Preferred; Tolerance: ±1%; Manufacturer Part Number: R0805_2K2_1%_0.125W_100PPM; Case: 0805; Mounted: Yes; Socket: No; SMD: Yes; Manufacturer1 Example: NIC COMPONENT; Manufacturer1 ComponentHeight: 0.6mm; HelpURL: \\cern.ch\dfs\Applications\Altium\Datasheets\R0805_NIC_NRC.pdf; Author: CERN DEM JLC; CreateDate: 03.12.2007; LatestRevisionDate: 13.03.2008
R18 R22 R23 = R0402_2K_1%_0.0625W_100PPM: Resistor - 1%; Part Description: General Purpose Thick Film Chip Resistor; Manufacturer: GENERIC; Manufacturer1 Part Number: 232270672002; TC: ±100ppm/°C; Part Number: R0402_2K_1%_0.0625W_100PPM; Component Kind: Standard; Component Type: Standard; Pin Count: 2; Value: 2k; Status: Not recommended; Power: 0.0625W; Tolerance: ±1%; Manufacturer Part Number: R0402_2K_1%_0.0625W_100PPM; Case: 0402; Mounted: Yes; Socket: No; SMD: Yes; Manufacturer1 Example: PHYCOMP; Manufacturer1 ComponentHeight: 0.4mm; HelpURL: \\cern.ch\dfs\Applications\Altium\Datasheets\R0402_Phycomp_RC0402.pdf; Author: CERN DEM JLC; CreateDate: 12/3/2007; LatestRevisionDate: 3/13/2008
R19 = R0603_1K_1%_0.1W_100PPM: Resistor - 1%; Part Description: General Purpose Thick Film Chip Resistor; Manufacturer: GENERIC; Manufacturer1 Part Number: NRC06F1001TRF; Power: 0.1W; TC: ±100ppm/°C; Part Number: R0603_1K_1%_0.1W_100PPM; Component Kind: Standard; Component Type: Standard; Pin Count: 2; Value: 1k; Status: Preferred; Tolerance: ±1%; Manufacturer Part Number: R0603_1K_1%_0.1W_100PPM; Case: 0603; Mounted: Yes; Socket: No; SMD: Yes; Manufacturer1 Example: NIC COMPONENT; Manufacturer1 ComponentHeight: 0.55mm; HelpURL: \\cern.ch\dfs\Applications\Altium\Datasheets\R0603_NIC_NRC.pdf; Author: CERN DEM JLC; CreateDate: 12/3/2007; LatestRevisionDate: 3/13/2008
R20 = R0805_20K_1%_0.125W_100PPM: Resistor - 1%; Part Description: General Purpose Thick Film Chip Resistor; Manufacturer: GENERIC; Manufacturer1 Part Number: NRC10F2002TRF; Power: 0.125W; TC: ±100ppm/°C; Part Number: R0805_20K_1%_0.125W_100PPM; Component Kind: Standard; Component Type: Standard; Pin Count: 2; Value: 20k; Status: Preferred; Tolerance: ±1%; Manufacturer Part Number: R0805_20K_1%_0.125W_100PPM; Case: 0805; Mounted: Yes; Socket: No; SMD: Yes; Manufacturer1 Example: NIC COMPONENT; Manufacturer1 ComponentHeight: 0.6mm; HelpURL: \\cern.ch\dfs\Applications\Altium\Datasheets\R0805_NIC_NRC.pdf; Author: CERN DEM JLC; CreateDate: 12/3/2007; LatestRevisionDate: 3/13/2008
R21 = R0805_100R_1%_0.125W_100PPM: Resistor - 1%; Part Description: General Purpose Thick Film Chip Resistor; Manufacturer: GENERIC; Manufacturer1 Part Number: NRC10F4700TRF; Power: 0.125W; TC: ±100ppm/°C; Part Number: R0805_100R_1%_0.125W_100PPM; Component Kind: Standard; Component Type: Standard; Pin Count: 2; Value: 100; Status: Preferred; Tolerance: ±1%; Manufacturer Part Number: R0805_100R_1%_0.125W_100PPM; Case: 0805; Mounted: Yes; Socket: No; SMD: Yes; Manufacturer1 Example: NIC COMPONENT; Manufacturer1 ComponentHeight: 0.6mm; HelpURL: \\cern.ch\dfs\Applications\Altium\Datasheets\R0805_NIC_NRC.pdf; Author: CERN DEM JLC; CreateDate: 12/3/2007; LatestRevisionDate: 3/13/2008
R24 = R0402_43K_1%_0.0625W_100PPM: Resistor - 1%; Part Description: General Purpose Thick Film Chip Resistor; Manufacturer: GENERIC; Manufacturer1 Part Number: 232270674303; TC: ±100ppm/°C; Part Number: R0402_43K_1%_0.0625W_100PPM; Component Kind: Standard; Component Type: Standard; Pin Count: 2; Value: 43k; Status: Not recommended; Power: 0.0625W; Tolerance: ±1%; Manufacturer Part Number: R0402_43K_1%_0.0625W_100PPM; Case: 0402; Mounted: Yes; Socket: No; SMD: Yes; Manufacturer1 Example: PHYCOMP; Manufacturer1 ComponentHeight: 0.4mm; HelpURL: \\cern.ch\dfs\Applications\Altium\Datasheets\R0402_Phycomp_RC0402.pdf; Author: CERN DEM JLC; CreateDate: 12/3/2007; LatestRevisionDate: 3/13/2008
R26 = R2512_1R0_1%_1W_100PPM: Resistor - 1%; Part Description: Current Sense Resistors; Manufacturer: KOA SPEER; Manufacturer Part Number: R2512_1R_1%_1W_100PPM; Manufacturer1 Part Number: SL1TTE1R00F; Power: 1W; TC: ±100ppm/°C; Part Number: R2512_1R0_1%_1W_100PPM; Component Kind: Standard; Component Type: Standard; Pin Count: 2; Value: 1; Status: Preferred; Tolerance: ±1%; Case: 2512; Mounted: Yes; Socket: No; SMD: Yes; Manufacturer1 Example: KOA SPEER; Manufacturer1 ComponentHeight: 0.65mm; Author: DEL; CreateDate: 3/21/2025; LatestRevisionDate: 3/21/2025
R27 = R0402_120K_1%_0.0625W_100PPM: Resistor - 1%; Part Description: General Purpose Thick Film Chip Resistor; Manufacturer: GENERIC; Manufacturer1 Part Number: 232270671204; TC: ±100ppm/°C; Part Number: R0402_120K_1%_0.0625W_100PPM; Component Kind: Standard; Component Type: Standard; Pin Count: 2; Value: 120k; Status: Not recommended; Power: 0.0625W; Tolerance: ±1%; Manufacturer Part Number: R0402_120K_1%_0.0625W_100PPM; Case: 0402; Mounted: Yes; Socket: No; SMD: Yes; Manufacturer1 Example: PHYCOMP; Manufacturer1 ComponentHeight: 0.4mm; HelpURL: \\cern.ch\dfs\Applications\Altium\Datasheets\R0402_Phycomp_RC0402.pdf; Author: CERN DEM JLC; CreateDate: 12/3/2007; LatestRevisionDate: 3/13/2008
R28 = FC4L64R050FER: Power and Current Sensing Resistor; Part Description: FC4L Four Terminal Current Sense resistor; Manufacturer: OHM; Power: 2W; TC: ±50ppm/°C; Tolerance: ±1%; Part Number: FC4L64R050FER; Component Kind: Standard; Component Type: Standard; Pin Count: 4; Value: 50m; Status: Preferred; Manufacturer Part Number: FC4L64R050FER; Case: FC4L64_OHM; Mounted: Yes; Socket: No; SMD: Yes; ComponentHeight: 0.5mm; Author: DEL; CreateDate: 3/30/2024; LatestRevisionDate: 3/30/2024
R33 = R0402_680R_0.1%_0.063W_10PPM: Resistor - 0.1%; Part Description: General Purpose Thick Film Chip Resistor; Manufacturer: GENERIC; Manufacturer Part Number: R0402_680R_0.1%_0.0625W_10PPM; Manufacturer1 Part Number: ERA-2ARB681X; Power: 0.0625W; TC: ±10ppm/°C; Part Number: R0402_680R_0.1%_0.063W_10PPM; Component Kind: Standard; Component Type: Standard; Pin Count: 2; Value: 680; Status: Not recommended; Tolerance: ±0.1%; Case: 0402; Mounted: Yes; Socket: No; SMD: Yes; Manufacturer1 Example: PANASONIC; Manufacturer1 ComponentHeight: 0.4mm; Author: DEL; CreateDate: 3/21/2025; LatestRevisionDate: 3/21/2025
R34 = R0402_255R_0.1%_0.063W_10PPM: Resistor - 0.1%; Part Description: General Purpose Thick Film Chip Resistor; Manufacturer: GENERIC; Manufacturer Part Number: R0402_255R_0.1%_0.0625W_10PPM; Manufacturer1 Part Number: ERA-2ARB2550X; Power: 0.0625W; TC: ±10ppm/°C; Part Number: R0402_255R_0.1%_0.063W_10PPM; Component Kind: Standard; Component Type: Standard; Pin Count: 2; Value: 255; Status: Not recommended; Tolerance: ±0.1%; Case: 0402; Mounted: Yes; Socket: No; SMD: Yes; Manufacturer1 Example: PANASONIC; Manufacturer1 ComponentHeight: 0.4mm; Author: DEL; CreateDate: 3/21/2025; LatestRevisionDate: 3/21/2025
R36 R39 R46 R48 R52 R56 = R0402_4K7_1%_0.0625W_100PPM: Resistor - 1%; Part Description: General Purpose Thick Film Chip Resistor; Manufacturer: GENERIC; Manufacturer1 Part Number: 232270674702; TC: ±100ppm/°C; Part Number: R0402_4K7_1%_0.0625W_100PPM; Component Kind: Standard; Component Type: Standard; Pin Count: 2; Value: 4k7; Status: Not recommended; Power: 0.0625W; Tolerance: ±1%; Manufacturer Part Number: R0402_4K7_1%_0.0625W_100PPM; Case: 0402; Mounted: Yes; Socket: No; SMD: Yes; Manufacturer1 Example: PHYCOMP; Manufacturer1 ComponentHeight: 0.4mm; HelpURL: \\cern.ch\dfs\Applications\Altium\Datasheets\R0402_Phycomp_RC0402.pdf; Author: CERN DEM JLC; CreateDate: 12/3/2007; LatestRevisionDate: 3/13/2008
R37 R42 R61 R62 = R0402_10K_1%_0.0625W_100PPM: Resistor - 1%; Part Description: General Purpose Thick Film Chip Resistor; Manufacturer: GENERIC; Manufacturer1 Part Number: 232270671003; TC: ±100ppm/°C; Part Number: R0402_10K_1%_0.0625W_100PPM; Component Kind: Standard; Component Type: Standard; Pin Count: 2; Value: 10k; Status: Not recommended; Power: 0.0625W; Tolerance: ±1%; Manufacturer Part Number: R0402_10K_1%_0.0625W_100PPM; Case: 0402; Mounted: Yes; Socket: No; SMD: Yes; Manufacturer1 Example: PHYCOMP; Manufacturer1 ComponentHeight: 0.4mm; HelpURL: \\cern.ch\dfs\Applications\Altium\Datasheets\R0402_Phycomp_RC0402.pdf; Author: CERN DEM JLC
  R37 R42: CreateDate: 03.12.2007; LatestRevisionDate: 13.03.2008
  R61 R62: CreateDate: 12/3/2007; LatestRevisionDate: 3/13/2008
R40 = R0402_12K_0.1%_0.063W_10PPM: Resistor - 0.1%; Part Description: General Purpose Thick Film Chip Resistor; Manufacturer: GENERIC; Manufacturer Part Number: R0402_12K_0.1%_0.0625W_10PPM; Manufacturer1 Part Number: ERA-2VRB1202X / ERA-2ARB2550X; Power: 0.0625W; TC: ±10ppm/°C; Part Number: R0402_12K_0.1%_0.063W_10PPM; Component Kind: Standard; Component Type: Standard; Pin Count: 2; Value: 12k; Status: Not recommended; Tolerance: ±0.1%; Case: 0402; Mounted: Yes; Socket: No; SMD: Yes; Manufacturer1 Example: PANASONIC; Manufacturer1 ComponentHeight: 0.4mm; Author: DEL; CreateDate: 3/21/2025; LatestRevisionDate: 3/21/2025
R41 = R0402_75R_0.1%_0.063W_10PPM: Resistor - 0.1%; Part Description: General Purpose Thick Film Chip Resistor; Manufacturer: GENERIC; Manufacturer Part Number: R0402_75R_0.1%_0.0625W_10PPM; Manufacturer1 Part Number: RN73C1E75RBTD / ERA-2ARB2550X; Power: 0.0625W; TC: ±10ppm/°C; Part Number: R0402_75R_0.1%_0.063W_10PPM; Component Kind: Standard; Component Type: Standard; Pin Count: 2; Value: 75; Status: Not recommended; Tolerance: ±0.1%; Case: 0402; Mounted: Yes; Socket: No; SMD: Yes; Manufacturer1 Example: TE CONNECTIVITY; Manufacturer1 ComponentHeight: 0.4mm; Author: DEL; CreateDate: 3/21/2025; LatestRevisionDate: 3/21/2025
R49 R50 = R0402_100K_0.1%_0.063W_10PPM: Resistor - 0.1%; Part Description: General Purpose Thick Film Chip Resistor; Manufacturer: GENERIC; Manufacturer Part Number: R0402_100K_0.1%_0.0625W_10PPM; Manufacturer1 Part Number: TNPW0402100KBYED; Power: 0.0625W; TC: ±10ppm/°C; Part Number: R0402_100K_0.1%_0.063W_10PPM; Component Kind: Standard; Component Type: Standard; Pin Count: 2; Value: 100k; Status: Not recommended; Tolerance: ±0.1%; Case: 0402; Mounted: Yes; Socket: No; SMD: Yes; Manufacturer1 Example: VISHAY; Manufacturer1 ComponentHeight: 0.4mm; Author: DEL; CreateDate: 3/21/2025; LatestRevisionDate: 3/21/2025
R53 = R0805_1R_1%_0.125W_200PPM: Resistor - 1%; Part Description: General Purpose Thick Film Chip Resistor; Manufacturer: GENERIC; Manufacturer1 Part Number: 232273461008; Power: 0.125W; TC: ±200ppm/°C; Part Number: R0805_1R_1%_0.125W_200PPM; Component Kind: Standard; Component Type: Standard; Pin Count: 2; Value: 1; Status: Preferred; Tolerance: ±1%; Manufacturer Part Number: R0805_1R_1%_0.125W_200PPM; Case: 0805; Mounted: Yes; Socket: No; SMD: Yes; Manufacturer1 Example: PHYCOMP; Manufacturer1 ComponentHeight: 0.65mm; HelpURL: \\cern.ch\dfs\Applications\Altium\Datasheets\R0805_Tyco_RN73.pdf; Author: CERN DEM JLC; CreateDate: 12/3/2007; LatestRevisionDate: 6/24/2009
R54 R55 = R0402_8K45_0.1%_0.063W_10PPM: Resistor - 0.1%; Part Description: General Purpose Thick Film Chip Resistor; Manufacturer: GENERIC; Manufacturer Part Number: R0402_8K45_0.1%_0.0625W_10PPM; Manufacturer1 Part Number: ERA-2ARB8451X; Power: 0.0625W; TC: ±10ppm/°C; Part Number: R0402_8K45_0.1%_0.063W_10PPM; Component Kind: Standard; Component Type: Standard; Pin Count: 2; Value: 8k45; Status: Not recommended; Tolerance: ±0.1%; Case: 0402; Mounted: Yes; Socket: No; SMD: Yes; Manufacturer1 Example: PANASONIC; Manufacturer1 ComponentHeight: 0.4mm; Author: DEL; CreateDate: 3/21/2025; LatestRevisionDate: 3/21/2025
R58 R60 = R0402_0R_JUMPER: Resistor - 1%; Part Description: 1A (0.05R Max DC Resistance) Zero Ohm Jumper; Manufacturer: GENERIC; Manufacturer1 Part Number: 232270591001; Part Number: R0402_0R_JUMPER; Component Kind: Standard; Component Type: Standard; Pin Count: 2; Value: 0; Status: Not recommended; Manufacturer Part Number: R0402_0R_JUMPER; Case: 0402; Mounted: Yes; Socket: No; SMD: Yes; Manufacturer1 Example: PHYCOMP; Manufacturer1 ComponentHeight: 0.4mm; HelpURL: \\cern.ch\dfs\Applications\Altium\Datasheets\R0402_Phycomp_RC0402.pdf; Author: CERN DEM JLC; CreateDate: 12/3/2007; LatestRevisionDate: 3/13/2008
R64 R65 = R0402_13K_1%_0.0625W_100PPM: Resistor - 1%; Part Description: General Purpose Thick Film Chip Resistor; Manufacturer: GENERIC; Manufacturer1 Part Number: 232270671303; TC: ±100ppm/°C; Part Number: R0402_13K_1%_0.0625W_100PPM; Component Kind: Standard; Component Type: Standard; Pin Count: 2; Value: 13k; Status: Not recommended; Power: 0.0625W; Tolerance: ±1%; Manufacturer Part Number: R0402_13K_1%_0.0625W_100PPM; Case: 0402; Mounted: Yes; Socket: No; SMD: Yes; Manufacturer1 Example: PHYCOMP; Manufacturer1 ComponentHeight: 0.4mm; HelpURL: \\cern.ch\dfs\Applications\Altium\Datasheets\R0402_Phycomp_RC0402.pdf; Author: CERN DEM JLC; CreateDate: 12/3/2007; LatestRevisionDate: 3/13/2008
TP1-TP4 = TP_SMD_0.8MM: Test Point; Part Description: 0.8mm round SMD Pad; Mounted: No; Part Number: TP_SMD_0.8MM; Component Kind: Standard (No BOM); Component Type: Standard (No BOM); Pin Count: 1; Family: Test Point; Socket: No; SMD: No; Status: None; ComponentHeight: 0mm; Author: DEL; CreateDate: 14.11.2017; LatestRevisionDate: 14.11.2017; PackageDescription: 0.8mm round SMD Pad
TP5 TP6 = TP_SMD_0.8MM: Part Description: 0.8mm round SMD Pad; Mounted: No; Part Number: TP_SMD_0.8MM; Component Kind: Standard (No BOM); Component Type: Standard (No BOM); Pin Count: 1; Family: Test Point; Socket: No; SMD: No; Status: None; ComponentHeight: 0mm; Author: DEL; CreateDate: 14.11.2017; LatestRevisionDate: 14.11.2017; PackageDescription: 0.8mm round SMD Pad
U1 = DS18B20_h_outside: Part Description: Programmable Resolution 1-Wire Digital Thermometer / 1-Wire Digital Thermometer; Manufacturer: MAXIM; Part Number: DS18B20_h_outside; Component Kind: Standard; Component Type: Standard; Device: DS18B20; PackageDescription: The TO-92 package HORIZONTAL, OUTSIDE; Manufacturer Part Number: DS18B20; Pin Count: 3; Case: TO-92; Mounted: Yes; Socket: Yes; SMD: No; ComponentHeight: 3.5mm; Author: DEL; CreateDate: 09.05.2018; LatestRevisionDate: 09.05.2018
U2 = AD8608ARUZ-REEL: Quad Operational Amplifier; Part Description: Precision, Low Noise, CMOS, Rail-to-Rail, Input/Output Operational Amplifiers; Manufacturer: ANALOG DEVICES; Part Number: AD8608ARUZ-REEL; Component Kind: Standard; Component Type: Standard; Device: AD8608; PackageDescription: SOP, 14-Leads, Body 4.4x5mm (max), Pitch 0.65mm, IPC Medium Density; Manufacturer Part Number: AD8608ARUZ-REEL; Pin Count: 14; Case: TSSOP14; Mounted: Yes; Socket: No; SMD: Yes; ComponentHeight: 1.1mm; Author: DEL; CreateDate: 21.12.2017; LatestRevisionDate: 21.12.2017
U3 = NUP4202W1: ESD Protection Diode, Low  Clamping Voltage; Manufacturer: ON SEMICONDUCTOR; Manufacturer Part Number: NUP4202W1T2G; Part Number: NUP4202W1; Component Kind: Standard; Component Type: Standard; Device: NUP4202; PackageDescription: SOT363, 0.65mm pitch; 6 pin, 1.25mm W X 2mm L, IPC Medium Density; Part Description: ESD Protection Diode, Low  Clamping Voltage; Pin Count: 6; Case: SOT363; Mounted: Yes; Socket: No; SMD: Yes; ComponentHeight: 1.1mm; Author: DEL; CreateDate: 10.11.2017; LatestRevisionDate: 10.11.2017
U4 U15 U16 = AD8605ARTZ: Operational Amplifier; Part Description: Precision, Low Noise, CMOS, Rail-to-Rail, Input/Output Operational Amplifiers; Manufacturer: ANALOG DEVICES; Manufacturer Part Number: AD8605ARTZ-REEL7; Part Number: AD8605ARTZ; Component Kind: Standard; Component Type: Standard; Device: AD8605; PackageDescription: SOT, 0.95mm pitch; 5 pin, 1.60mm W X 2.90mm L X 1.45mm H body, IPC Medium Density; Pin Count: 5; Case: SOT23-5; Mounted: Yes; Socket: No; SMD: Yes; ComponentHeight: 1.45mm; Author: DEL; CreateDate: 1/7/2025; LatestRevisionDate: 1/7/2025
U5 = LP2985A-33DBV: 150mA Low-Noise Low-Dropout Regulator Whit Shutdown; Part Description: 3.3V, 150mA Low-Noise Low-Dropout Regulator Whit Shutdown; Manufacturer: TEXAS INSTRUMENTS; Part Number: LP2985A-33DBV; Component Kind: Standard; Component Type: Standard; Device: LP2985A-33DBV; PackageDescription: SOT, 0.95mm pitch; 5 pin, 1.60mm W X 2.90mm L X 1.45mm H body, IPC Medium Density; Manufacturer Part Number: LP2985A-33DBV; Pin Count: 5; Case: SOT23-5; Mounted: Yes; Socket: No; SMD: Yes; ComponentHeight: 1.45mm; HelpURL: \\cern.ch\dfs\Applications\Altium\Datasheets\LP2985A-33DBV.pdf; Author: CERN DEM JLC; CreateDate: 17.03.2011; LatestRevisionDate: 17.03.2011
U6 = LP2985A-50DBVRG4: 150mA Low-Noise Low-Dropout Regulator Whit Shutdown; Part Description: 5V, 150mA Low-Noise Low-Dropout Regulator Whit Shutdown; Manufacturer: TEXAS INSTRUMENTS; Part Number: LP2985A-50DBV; Component Kind: Standard; Component Type: Standard; Device: LP2985A-50DBV; PackageDescription: SOT, 0.95mm pitch; 5 pin, 1.60mm W X 2.90mm L X 1.45mm H body, IPC Medium Density; Manufacturer Part Number: LP2985A-50DBVRG4; Pin Count: 5; Case: SOT23-5; Mounted: Yes; Socket: No; SMD: Yes; ComponentHeight: 1.45mm; Author: DEL; CreateDate: 19.12.2017; LatestRevisionDate: 19.12.2017
U7 = KIA7812API_h_outside: 3-Terminal Regulator 1=IN 2=GND 3=OUT; Part Description: 3-Terminal 12V 1A Positive Voltage Regulator; Manufacturer: KEC; Part Number: KIA7812API_h_outside; Component Kind: Standard; Component Type: Standard; Device: KIA7812; PackageDescription: TO-220 3-Terminal  Horizontal Outside Mount; Manufacturer Part Number: KIA7812API; Pin Count: 3; Case: TO-220; Mounted: Yes; Socket: No; SMD: No; ComponentHeight: 10mm; Author: DEL; CreateDate: 06.05.2018; LatestRevisionDate: 06.05.2018
U8 = LM27761: LM27761 Low-Noise, Regulated, Switched-Capacitor Voltage Inverter; Manufacturer: TEXAS INSTRUMENTS; Manufacturer Part Number: LM27761DSGR; Part Number: LM27761; Component Kind: Standard; Component Type: Standard; Device: LM27761; PackageDescription: SON, 0.5mm,pitch; 8 pin, 2.00mm W X 2.00mm L X 0.80mm H body; Part Description: LM27761 Low-Noise, Regulated, Switched-Capacitor Voltage Inverter; Pin Count: 6; Case: WSON; Mounted: Yes; Socket: No; SMD: Yes; ComponentHeight: 0.8mm; Author: DEL; CreateDate: 1/19/2025; LatestRevisionDate: 1/19/2025
U9 U11 = TMP236A2DBZR: Low-Power, High-Accuracy Analog Output Temperature Sensors; Manufacturer: TEXAS INSTRUMENTS; Part Number: TMP236A2DBZR; Component Kind: Standard; Component Type: Standard; Device: TMP236; PackageDescription: SOT23, 3 pin, Pitch 0.95mm - 1.3mm W X 2.9mm L X 1.1mm H, IPC Medium Density; Part Description: Low-Power, High-Accuracy Analog Output Temperature Sensors; Manufacturer Part Number: TMP236A2DBZR; Pin Count: 3; Case: SOT23; Mounted: Yes; Socket: No; SMD: Yes; ComponentHeight: 1.1mm; Author: DEL; CreateDate: 12/11/2024; LatestRevisionDate: 12/11/2024
U10 = LTC6655BHMS8-3.3: Part Description: 0.25ppm Noise, Low Drift Precision References; Manufacturer: LINEAR TECHNOLOGY; Manufacturer Part Number: LTC3810EUH-5#PBF; Part Number: LTC6655BHMS8-3.3; Component Kind: Standard; Component Type: Standard; Device: LTC6655BHMS8-3.3; PackageDescription: SOP, 0.65mm pitch; 8 pin,3.00mm W X 3.00mm L X 1.10mm H body, IPC Medium Density; Pin Count: 33; Case: MSOP8; Mounted: Yes; Socket: No; SMD: Yes; ComponentHeight: 1.1mm; Author: DEL; CreateDate: 1/23/2025; LatestRevisionDate: 1/23/2025
U12 U13 = AD8421BRMZ-R: 3 nV/√Hz, Low Power Instrumentation Amplifier; Manufacturer: ANALOG DEVICES; Part Number: AD8421BRMZ-R; Component Kind: Standard; Component Type: Standard; Device: AD8421; PackageDescription: SOP, 0.65mm pitch; 8 pin, 3.00mm W X 3.00mm L X 1.10mm H body, IPC Medium Density; Part Description: 3 nV/√Hz, Low Power Instrumentation Amplifier; Manufacturer Part Number: AD8421BRMZ-R; Pin Count: 8; Case: MSOP8; Mounted: Yes; Socket: No; SMD: Yes; ComponentHeight: 1.1mm; Author: DEL; CreateDate: 1/7/2025; LatestRevisionDate: 1/7/2025
U14 = LMC7101AIM5X/NOPB: Operational Amplifier; Part Description: 2.7-15V, Rail-to-Rail I/O Amplifier; Manufacturer: TEXAS INSTRUMENTS; Part Number: LMC7101AIM5X/NOPB; Component Kind: Standard; Component Type: Standard; Device: LMC7101; PackageDescription: SOT, 0.95mm pitch; 5 pin, 1.60mm W X 2.90mm L X 1.45mm H body, IPC Medium Density; Manufacturer Part Number: LMC7101AIM5X/NOPB; Pin Count: 5; Case: SOT23-5; Mounted: Yes; Socket: No; SMD: Yes; ComponentHeight: 1.45mm; Author: DEL; CreateDate: 29.01.2018; LatestRevisionDate: 29.01.2018
U17 U21 = AD5060BRJZ: Part Description: Fully Accurate 16-Bit VOUT DAC, SPI Interface 2.7 V to 5.5 V, in an SOT-23; Manufacturer: ANALOG DEVICES; Part Number: AD5060BRJZ; Component Kind: Standard; Component Type: Standard; Device: AD5060; PackageDescription: SOT, 0.65mm pitch; 8 pin, 1.625mm W X 2.90mm L X 1.45mm H body, IPC Medium Density; Manufacturer Part Number: AD5060BRJZ; Pin Count: 8; Case: SOT23-8; Mounted: Yes; Socket: No; SMD: Yes; ComponentHeight: 1.45mm; Author: DEL; CreateDate: 10/8/2025; LatestRevisionDate: 10/8/2025
U18 = TS5A3159DCKR: 1-Ω SPDT Analog Switch; Manufacturer: TEXAS INSTRUMENTS; Manufacturer Part Number: ADS1271IBPW; Part Number: TS5A3159DCKR; Component Kind: Standard; Component Type: Standard; Device: TS5A3159; PackageDescription: SC70-6, SOT, 0.65mm Pitch, 6 pin; Part Description: 1-Ω SPDT Analog Switch; Pin Count: 6; Case: SC70-6; Mounted: Yes; Socket: No; SMD: Yes; ComponentHeight: 1.1mm; Author: DEL; CreateDate: 6/20/2022; LatestRevisionDate: 6/20/2022
U19 = STM32F373CCT6: ARM®Cortex®-M4 32b MCU+FPU, up to 256KB Flash+32KB SRAM, timers, 4 ADCs (16-bit Sig. Delta / 12-bit SAR), 3 DACs, 2 comp., 2.0-3.6 V; Manufacturer: ST Microelectronics; Part Number: STM32F373CCT6; Component Kind: Standard; Component Type: Standard; Device: STM32F373CCT6; PackageDescription: Thin QFP, 48-Leads, Body 7x7mm, Pitch 0.5mm, IPC Medium Density; Part Description: ARM®Cortex®-M4 32b MCU+FPU, up to 256KB Flash+32KB SRAM, timers, 4 ADCs (16-bit Sig. Delta / 12-bit SAR), 3 DACs, 2 comp., 2.0-3.6 V; Manufacturer Part Number: STM32F373CCT6; Pin Count: 48; Case: LQFP48; Mounted: Yes; Socket: No; SMD: Yes; ComponentHeight: 1.6; Author: D_EL; CreateDate: 21.04.2017; LatestRevisionDate: 21.04.2017
U20 = AD4680: Differential Inputs, 1 MSPS/500 kSPS, Dual Simultaneous Sampling SAR ADCs; Manufacturer: ANALOG DEVICES; Manufacturer Part Number: AD4680BCPZ-RL7; Part Number: AD4680; Component Kind: Standard; Component Type: Standard; Device: AD4680; PackageDescription: QFN,0.50mm pitch,square; 4 pin X 4 pin, 3mm X 3mm X 0.80mm H body (w/thermal tab 1.2 X 1.2mm),  IPC Medium Density; Part Description: Differential Inputs, 1 MSPS/500 kSPS, Dual Simultaneous Sampling SAR ADCs; Pin Count: 16; Case: LFCSP-16; Mounted: Yes; Socket: No; SMD: Yes; ComponentHeight: 0.8mm; Author: DEL; CreateDate: 1/7/2025; LatestRevisionDate: 1/7/2025